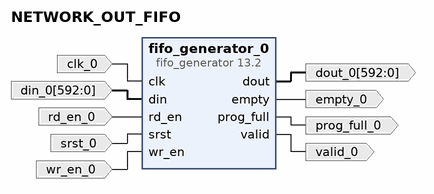
[diagram p0: block diagram of the top level]
# Vivado block design NETWORK_OUT_FIFO, xcu280-fsvh2892-2L-e, Vivado 2021.2
create_bd_design NETWORK_OUT_FIFO

create_bd_port -dir I -type clk clk_0
create_bd_port -dir I -from 592 -to 0 din_0
create_bd_port -dir O -from 592 -to 0 dout_0
create_bd_port -dir O empty_0
create_bd_port -dir O prog_full_0
create_bd_port -dir I rd_en_0
create_bd_port -dir I srst_0
create_bd_port -dir O valid_0
create_bd_port -dir I wr_en_0

create_bd_cell -type ip -vlnv xilinx.com:ip:fifo_generator:13.2 fifo_generator_0
set_property -dict [list \
  CONFIG.Full_Threshold_Assert_Value 500 \
  CONFIG.Input_Data_Width 593 \
  CONFIG.Input_Depth 512 \
  CONFIG.Performance_Options First_Word_Fall_Through \
  CONFIG.Programmable_Full_Type Single_Programmable_Full_Threshold_Constant \
  CONFIG.Valid_Flag true \
] [get_bd_cells fifo_generator_0]

# ---- connections ----

connect_bd_net -net clk_0_1 [get_bd_ports clk_0] [get_bd_pins fifo_generator_0/clk]
connect_bd_net -net din_0_1 [get_bd_ports din_0] [get_bd_pins fifo_generator_0/din]
connect_bd_net [get_bd_pins fifo_generator_0/dout] [get_bd_ports dout_0]
connect_bd_net [get_bd_pins fifo_generator_0/empty] [get_bd_ports empty_0]
connect_bd_net [get_bd_pins fifo_generator_0/prog_full] [get_bd_ports prog_full_0]
connect_bd_net [get_bd_pins fifo_generator_0/valid] [get_bd_ports valid_0]
connect_bd_net -net rd_en_0_1 [get_bd_ports rd_en_0] [get_bd_pins fifo_generator_0/rd_en]
connect_bd_net -net srst_0_1 [get_bd_ports srst_0] [get_bd_pins fifo_generator_0/srst]
connect_bd_net -net wr_en_0_1 [get_bd_ports wr_en_0] [get_bd_pins fifo_generator_0/wr_en]

validate_bd_design
save_bd_design
